# EAGLE design bgm121_breakout_board_v10 (EAGLE 7.7.0)
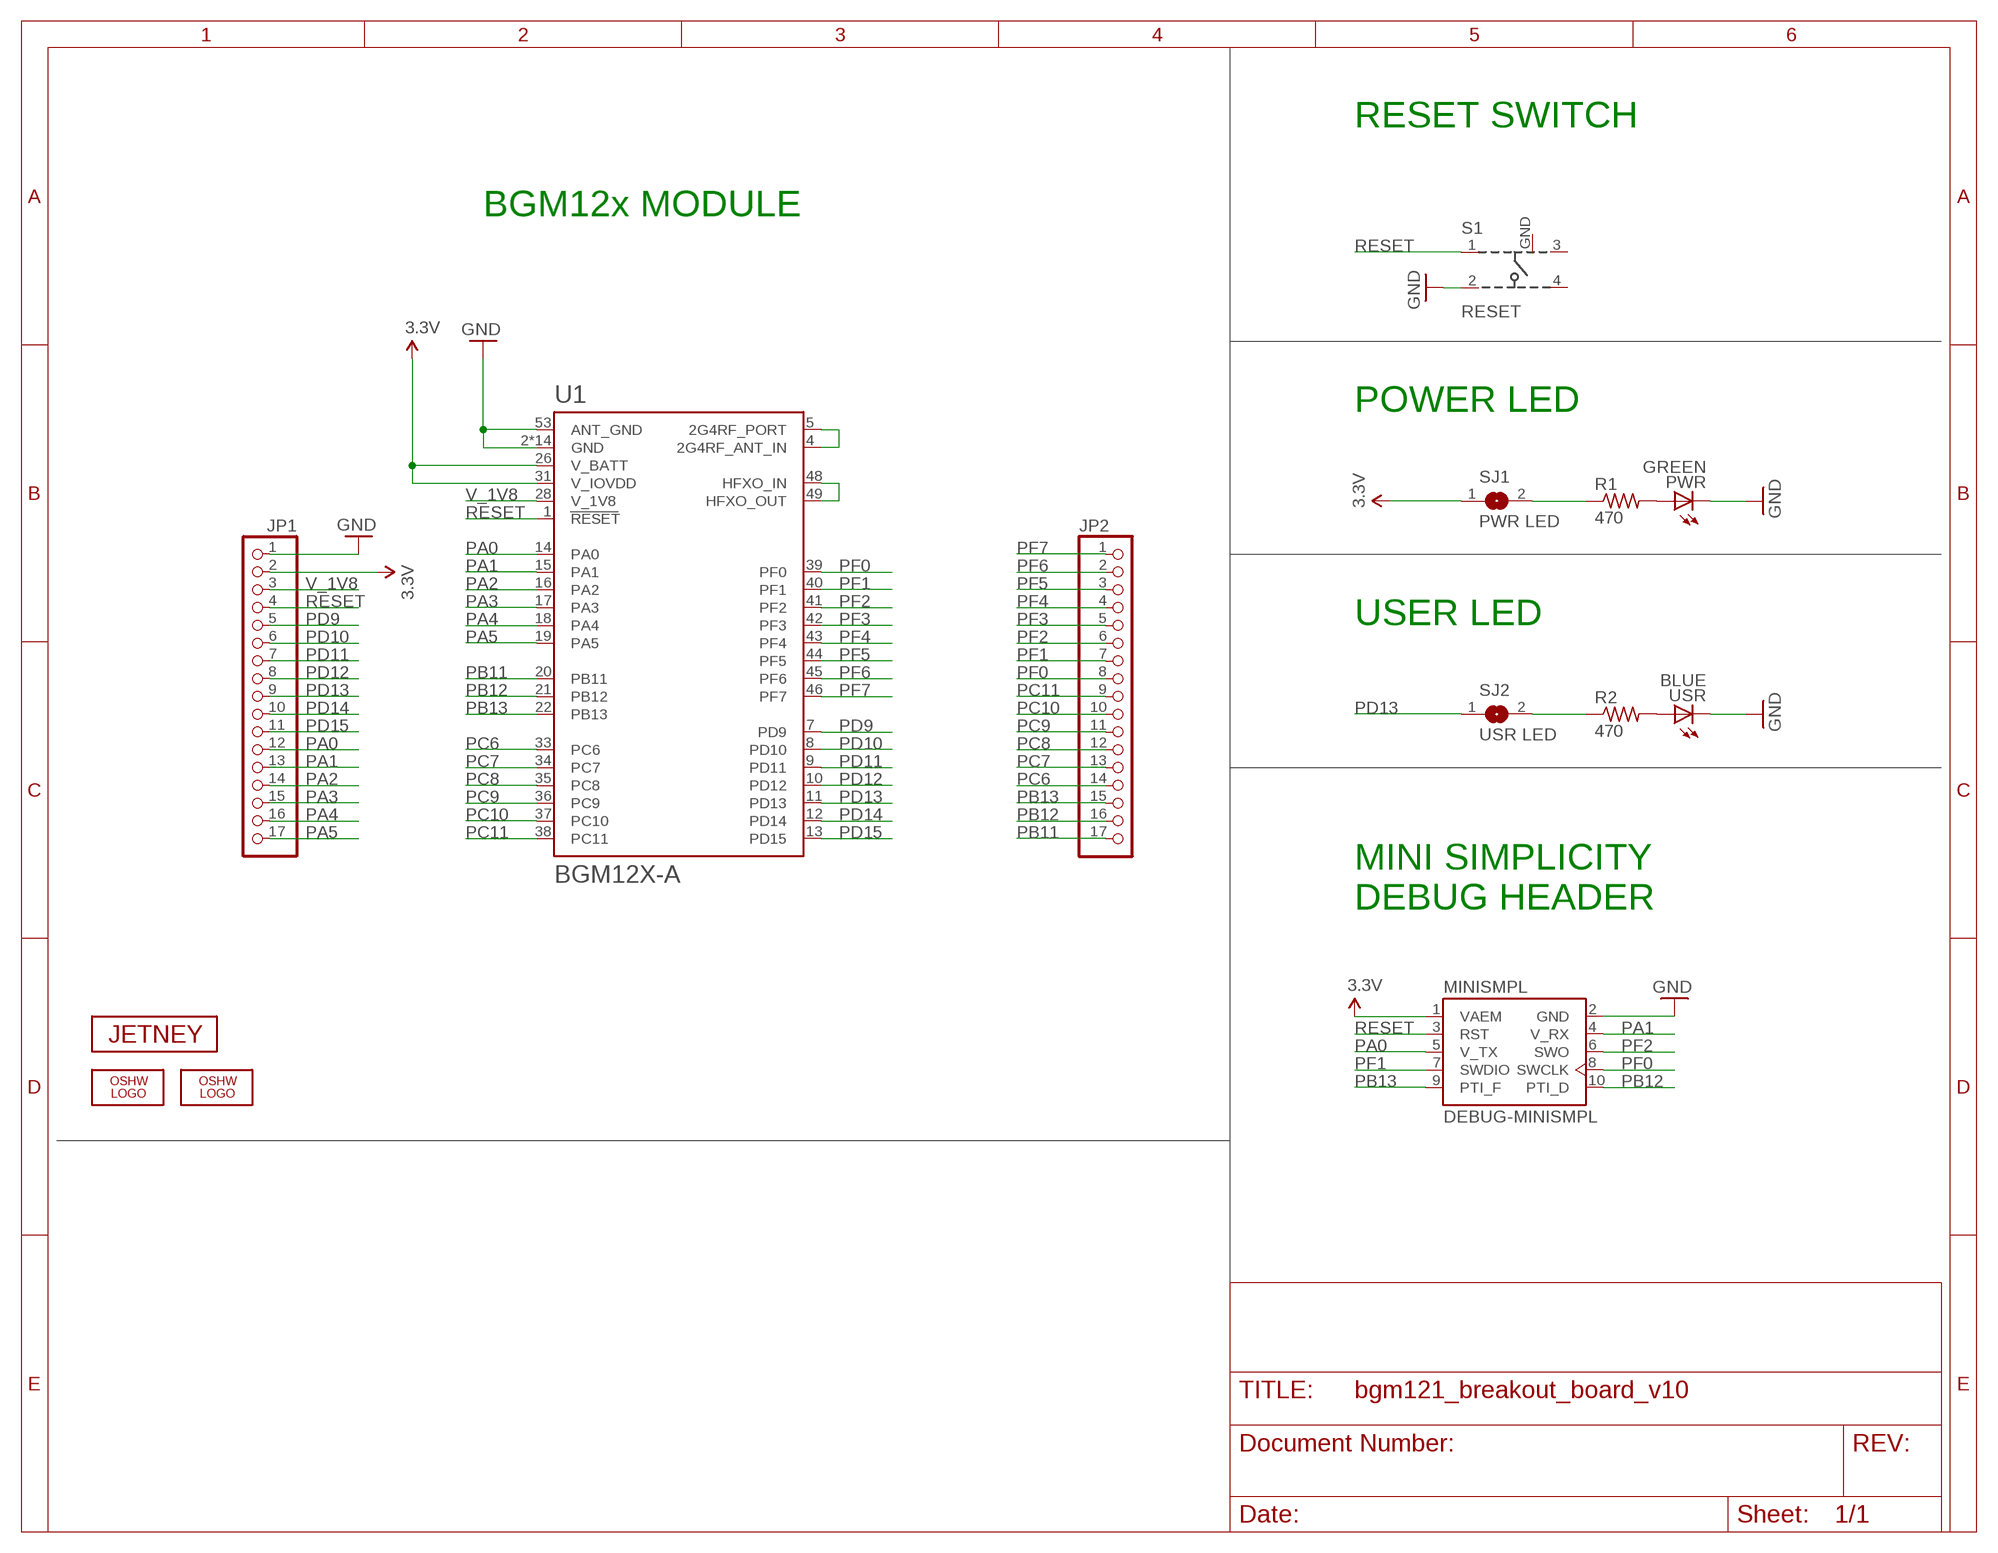
[diagram p0: schematic, sheet 1]

## Parts
JP1  PINHD-1X17  [1X17]
JP2  PINHD-1X17  [1X17]
LOGO1  OSHW_LOGO_FILLX0100-NT  [OSHW_FILLX100_NOTEXT]
LOGO2  OSHW_LOGO_FILLX0070-NT  [OSHW_FILLX70_NOTEXT]
MINISMPL  DEBUG-MINISMPL  [DEBUG-50MIL]
PWR  GREEN  LEDCHIPLED_0805  [CHIPLED_0805]
R1  470  R-US_R0603  [R0603]
R2  470  R-US_R0603  [R0603]
S1  RESET  101-IG  [101-IG]
SJ1  PWR LED  SJ  [SJ]
SJ2  USR LED  SJ  [SJ]
U1  BGM12X-A  [BGM12X-A]
U$2  JETNEY-LOGO-12  [JETNEY-LOGO-12]
USR  BLUE  LEDCHIPLED_0805  [CHIPLED_0805]

## Nets
2G4RF: U1.4(2G4RF_ANT_IN) U1.5(2G4RF_PORT)
3.3V [power]: JP1.2 MINISMPL.1(VAEM) SJ1.1 U1.26(V_BATT) U1.31(V_IOVDD)
GND [power]: JP1.1 MINISMPL.2(GND) PWR.C S1.2 U1.2(GND) U1.3(GND) U1.6(GND) U1.25(GND) U1.27(GND) U1.29(GND) U1.32(GND) U1.47(GND) U1.50(GND) U1.51(GND) U1.52(GND) U1.53(ANT_GND) U1.54(GND) U1.55(GND) U1.56(GND) USR.C
HFXO: U1.48(HFXO_IN) U1.49(HFXO_OUT)
N$1: PWR.A R1.2
N$3 [power]: R1.1 SJ1.2
N$4: R2.2 USR.A
N$5: R2.1 SJ2.2
PA0: JP1.12 MINISMPL.5(V_TX) U1.14(PA0)
PA1: JP1.13 MINISMPL.4(V_RX) U1.15(PA1)
PA2: JP1.14 U1.16(PA2)
PA3: JP1.15 U1.17(PA3)
PA4: JP1.16 U1.18(PA4)
PA5: JP1.17 U1.19(PA5)
PB11: JP2.17 U1.20(PB11)
PB12: JP2.16 MINISMPL.10(PTI_D) U1.21(PB12)
PB13: JP2.15 MINISMPL.9(PTI_F) U1.22(PB13)
PC6: JP2.14 U1.33(PC6)
PC7: JP2.13 U1.34(PC7)
PC8: JP2.12 U1.35(PC8)
PC9: JP2.11 U1.36(PC9)
PC10: JP2.10 U1.37(PC10)
PC11: JP2.9 U1.38(PC11)
PD9: JP1.5 U1.7(PD9)
PD10: JP1.6 U1.8(PD10)
PD11: JP1.7 U1.9(PD11)
PD12: JP1.8 U1.10(PD12)
PD13: JP1.9 SJ2.1 U1.11(PD13)
PD14: JP1.10 U1.12(PD14)
PD15: JP1.11 U1.13(PD15)
PF0: JP2.8 MINISMPL.8(SWCLK) U1.39(PF0)
PF1: JP2.7 MINISMPL.7(SWDIO) U1.40(PF1)
PF2: JP2.6 MINISMPL.6(SWO) U1.41(PF2)
PF3: JP2.5 U1.42(PF3)
PF4: JP2.4 U1.43(PF4)
PF5: JP2.3 U1.44(PF5)
PF6: JP2.2 U1.45(PF6)
PF7: JP2.1 U1.46(PF7)
RESET: JP1.4 MINISMPL.3(RST) S1.1 U1.1(RESET)
V_1V8: JP1.3 U1.28(V_1V8)
Unconnected: S1.3 S1.4

## Notes on the sheet
- RESET SWITCH
- BGM12x MODULE
- POWER LED
- USER LED
- MINI SIMPLICITY
  DEBUG HEADER

## Power pins joined to a net without a drawn wire
GND: S1.GND

## Library data of the parts
JP1 JP2 = sf-pinhead:PINHD-1X17: PIN HEADER
LOGO1 LOGO2 = oshw-logo:OSHW_LOGO_FILL
MINISMPL = jetney-silabs-modules:DEBUG-MINISMPL
PWR USR = led:LED: LED OSRAM: - CHIPLED LG R971, LG N971, LY N971, LG Q971, LY Q971, LO R971, LY R971 LH N974, LH R974 LS Q976, LO Q976, LY Q976 LO Q996 - Hyper CHIPLED LW Q18S LB Q993, LB Q99A, LB R99A - SideLED LS A670, LO A670, LY A670, LG A670, LP A670 LB A673, LV A673, LT A673, LW A673 LH A674 LY A675 LS A676, LA A676, LO A676, LY A676, LW A676 LS A679, LY A679, LG A679 - Hyper Micro SIDELED® LS Y876, LA Y876, LO Y876, LY Y876 LT Y87S - SmartLED LW L88C, LW L88S LB L89C, LB L89S, LG L890 LS L89K, LO L89K, LY L89K LS L896, LA L896, LO L896, LY L896 - TOPLED LS T670, LO T670, LY T670, LG T670, LP T670 LSG T670, LSP T670, LSY T670, LOP T670, LYG T670 LG T671, LOG T671, LSG T671 LB T673, LV T673, LT T673, LW T673 LH T674 LS T676, LA T676, LO T676, LY T676, LB T676, LH T676, LSB T676, LW T676 LB T67C, LV T67C, LT T67C, LS T67K, LO T67K, LY T67K, LW E67C LS E67B, LA E67B, LO E67B, LY E67B, LB E67C, LV E67C, LT E67C LW T67C LS T679, LY T679, LG T679 LS T770, LO T770, LY T770, LG T770, LP T770 LB T773, LV T773, LT T773, LW T773 LH T774 LS E675, LA E675, LY E675, LS T675 LS T776, LA T776, LO T776, LY T776, LB T776 LHGB T686 LT T68C, LB T68C - Hyper Mini TOPLED® LB M676 - Mini TOPLED Santana® LG M470 LS M47K, LO M47K, LY M47K Source: http://www.osram.convergy.de LUXEON: - LUMILED® LXK2-PW12-R00, LXK2-PW12-S00, LXK2-PW14-U00, LXK2-PW14-V00 LXK2-PM12-R00, LXK2-PM12-S00, LXK2-PM14-U00 LXK2-PE12-Q00, LXK2-PE12-R00, LXK2-PE12-S00, LXK2-PE14-T00, LXK2-PE14-U00 LXK2-PB12-K00, LXK2-PB12-L00, LXK2-PB12-M00, LXK2-PB14-N00, LXK2-PB14-P00, LXK2-PB14-Q00 LXK2-PR12-L00, LXK2-PR12-M00, LXK2-PR14-Q00, LXK2-PR14-R00 LXK2-PD12-Q00, LXK2-PD12-R00, LXK2-PD12-S00 LXK2-PH12-R00, LXK2-PH12-S00 LXK2-PL12-P00, LXK2-PL12-Q00, LXK2-PL12-R00 Source: www.luxeon.com KINGBRIGHT: KA-3528ASYC Source: www.kingbright.com
R1 R2 = resistor:R-US_: RESISTOR, American symbol
S1 = sf-keyglove:101-IG
SJ1 SJ2 = jumper:SJ: SMD solder JUMPER
U1 = jetney-silabs-modules:BGM12X-A
U$2 = sf-keyglove:JETNEY-LOGO

## Net classes
0 default: width 0.152 mm, drill 0.33 mm, clearance 0.152 mm
1 power: width 0.254 mm, drill 0.33 mm, clearance 0.152 mm

## Board
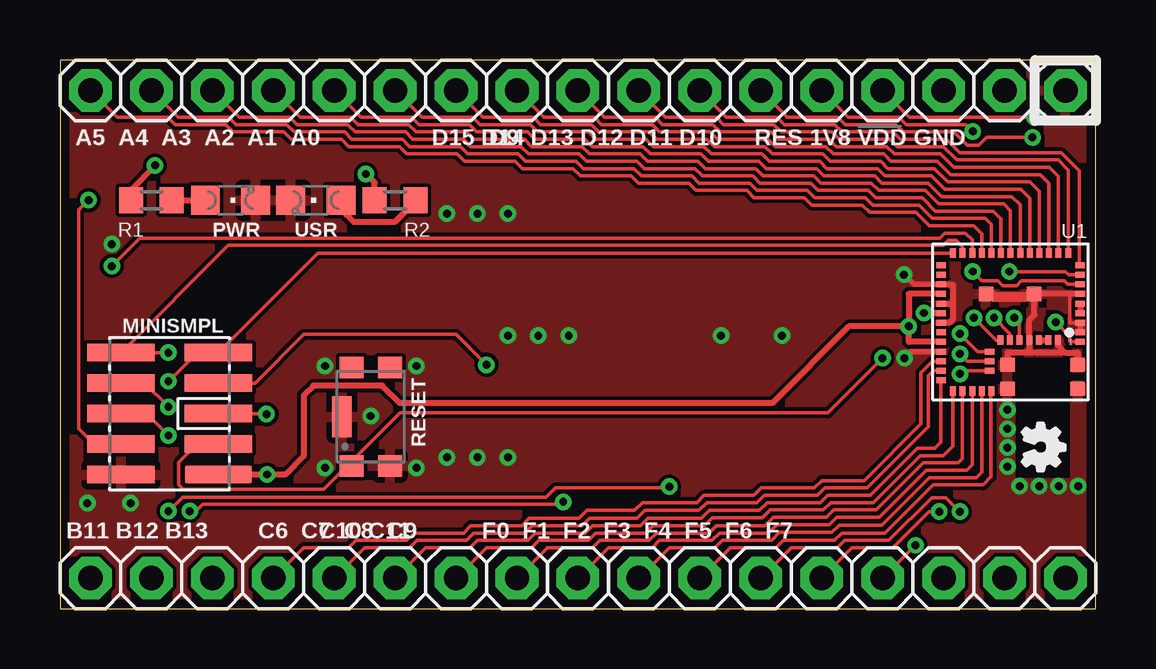
[diagram p1: board, top side]
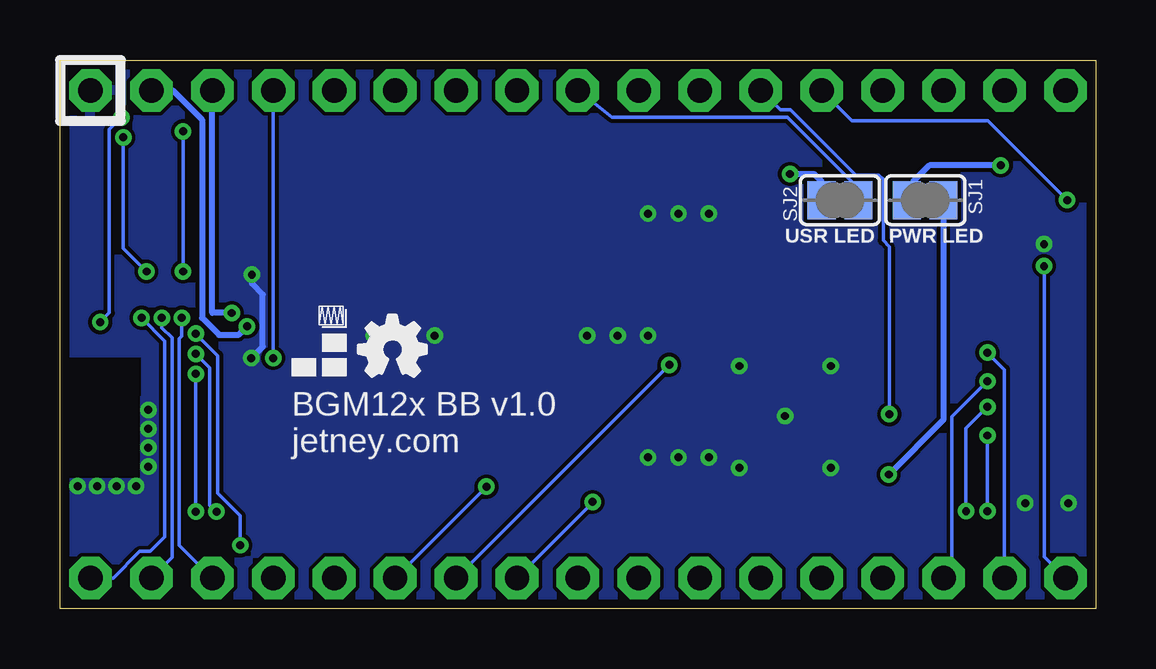
[diagram p2: board, bottom side, seen from below]

Size 43.18 x 22.86 mm. Coordinates in mm from the lower left corner, seen from the top.
Outline: 0,0 43.18,0 43.18,22.86 0,22.86 0,0
Copper layers (1*16): Top 0.0356mm / dielectric 1.5011mm / Bottom 0.0356mm
Design rules "default": minimum track width 6mil, minimum drill 13mil, track to track 6mil, track to pad 6mil, pad to pad 6mil, via to via 6mil, smd to smd 6mil, copper to edge 15mil, drill to drill 6mil, minimum pad ring 7mil, minimum via ring 7mil, stop-mask expansion 4mil, vias tented up to drill 13mil, thermal gap 10mil
tRestrict: area 39.9,5.5 to 42.1,8.9
bRestrict: area 39.9,5.5 to 42.9,8.9

### Footprints (pad centres in the part's own frame; a part is rotated, then mirrored left to right if it is on the bottom)
1X17 = drill 1.016 pad 1.778 octagon: 1 -20.32,0; 2 -17.78,0; 3 -15.24,0; 4 -12.7,0; 5 -10.16,0; 6 -7.62,0; 7 -5.08,0; 8 -2.54,0; 9 0,0; 10 2.54,0; 11 5.08,0; 12 7.62,0; 13 10.16,0; 14 12.7,0; 15 15.24,0; 16 17.78,0; 17 20.32,0
DEBUG-50MIL = smd 0.74 x 2.8: 1 -2.54,-2.03; 2 -2.54,2.03; 3 -1.27,-2.03; 4 -1.27,2.03; 5 0,-2.03; 6 0,2.03; 7 1.27,-2.03; 8 1.27,2.03; 9 2.54,-2.03; 10 2.54,2.03
CHIPLED_0805 = smd 1.2 x 1.2: A 0,-1.05; C 0,1.05
R0603 = smd 1 x 1.1: 1 -0.85,0; 2 0.85,0
101-IG = smd 0.9 x 1: 1 -2.05,0.8; 2 -2.05,-0.8; 3 2.05,0.8; 4 2.05,-0.8 | smd 1.7 x 0.8: GND 0,1.2
SJ = smd 1.168 x 1.6: 1 -0.762,0; 2 0.762,0
BGM12X-A = smd 0.4 x 0.25: 1 -2.9,0.85; 2 -2.9,0.45; 3 -2.9,0.05; 4 -2.9,-0.35; 5 -2.9,-0.75; 6 -2.9,-1.15; 7 -2.9,-1.55; 8 -2.9,-1.95; 9 -2.9,-2.35; 23 2.9,-2.35; 24 2.9,-1.95; 25 2.9,-1.55; 26 2.9,-1.15; 27 2.9,-0.75; 28 2.9,-0.35; 29 2.9,0.05; 30 2.9,0.45; 31 2.9,0.85; 32 2.9,1.25; 33 2.9,1.65; 34 2.9,2.05; 35 2.9,2.45; 41 0.875,2.055; 42 0.875,1.655; 43 0.875,1.255 | smd 0.25 x 0.4: 10 -2.4,-2.85; 11 -2,-2.85; 12 -1.6,-2.85; 13 -1.2,-2.85; 14 -0.8,-2.85; 15 -0.4,-2.85; 16 0,-2.85; 17 0.4,-2.85; 18 0.8,-2.85; 19 1.2,-2.85; 20 1.6,-2.85; 21 2,-2.85; 22 2.4,-2.85; 36 2.4,2.9; 37 2,2.9; 38 1.6,2.9; 39 1.2,2.9; 40 0.8,2.9; 44 0.425,0.775; 45 0.025,0.775; 46 -0.375,0.775; 47 -0.775,0.775; 48 -1.175,0.775; 49 -1.575,0.775; 50 -1.975,0.775 | smd 0.6 x 0.6: 51 -0.975,-1.15; 52 1.025,-1.15; 53 -2.8,2.8; 54 -2.8,1.8; 55 0.125,1.8; 56 0.125,2.8

### Placement (x,y rotation side)
JP1  21.59,21.59 180 top
JP2  21.59,1.27 180 top
LOGO1  30.73,9.68 0 bottom
LOGO2  40.11,7.72 270 top
MINISMPL  4.57,8.13 90 top
PWR  7.11,17.02 270 top
R1  3.81,17.02 0 top
R2  13.97,17.02 0 top
S1  12.95,8 90 top
SJ1  7.11,17.02 180 bottom
SJ2  10.67,17.02 180 bottom
U1  39.62,11.96 180 top
U$2  33.53,9.68 0 bottom
USR  10.67,17.02 90 top

### Tracks (layer width: path | path; a pad name or v marks a point on that pad's centre or on a via)
2G4RF
  Top 0.254: U1.5 U1.4
3.3V  (via drill 0.33)
  Top 0.254: U1.26 35.38,13.11 v35.38,11.76 | v35.38,11.76 32.89,11.76 29.69,8.56 14.17,8.56 13.44,9.3 10.57,9.3 10.16,8.89 10.16,6.35 9.4,5.59 v8.64,5.59 MINISMPL.1 | U1.31 35.4,11.11 v35.38,11.76
  Bottom 0.254: v35.38,11.76 35.74,11.4 36.55,11.4 37.26,12.12 37.26,20.37 38.48,21.59 JP1.2 | SJ1.1 6.35,7.87 v8.64,5.59
GND  (via drill 0.33)
  Top 0.152: 42.09,13.11 42.09,11.91 U1.3
  Top 0.229: U1.25 35.59,13.51 v35.18,13.92 | U1.32 35.48,10.71 v35.2,10.44
  Top 0.254: U1.6 42.09,13.11 U1.51 40.62,13.1 40.62,12.24 40.4,12.03 U1.47 40.4,10.78 40.28,10.67 | U1.50 41.6,10.97 41.91,10.67 | 41.91,10.67 42.42,10.67 | 42.42,10.67 U1.54 42.42,10.67 | U1.29 37.08,11.91 37.21,12.04 37.21,12.62 | U1.25 37.21,13.51 37.21,12.62 | U1.27 37.22,12.71 37.21,12.62 | 40.28,10.67 39.5,10.67 | 39.5,10.67 U1.55 | 41.91,10.67 40.28,10.67 | 39.5,10.67 | U1.3 U1.2
  Top 0.406: U1.52 38.78,13.11 38.89,13.01 40.28,13.01 40.39,13.08 40.57,13.08 U1.51
  Bottom 0.254: v35.2,10.44 34.72,10.92 34.72,13.08 35.18,13.54 v35.18,13.92
  other vias: 12.95,8.03 11.05,10.11 14.86,10.11 14.86,5.87 11.05,5.87 16.13,16.46 17.4,16.46 18.67,16.46 2.16,15.19 41.63,5.11 42.44,5.11 39.5,8.28 39.5,7.49 39.5,6.71 39.5,5.92 18.67,11.38 19.94,11.38 21.21,11.38 18.67,6.3 17.4,6.3 16.13,6.3 30.1,11.38 27.56,11.38 2.95,4.39 1.14,4.39 40.82,5.11 40.01,5.11
  pour Bottom: 0,22.86 43.18,22.86 43.18,0 0,0
  pour Top: 0,22.86 43.18,22.86 43.18,0 0,0
HFXO
  Top 0.254: U1.48 U1.49
N$1
  Top 0.254: R1.2 PWR.A
N$3  (via drill 0.33)
  Top 0.254: R1.1 2.96,17.46 v3.96,18.47
  Bottom 0.254: v3.96,18.47 6.93,18.47 7.62,17.78 7.62,17.27 SJ1.2
N$4
  Top 0.254: R2.2 14.82,16.98 13.95,16.1 12.24,16.1 11.94,16.41 11.94,16.8 USR.A
N$5  (via drill 0.33)
  Top 0.254: R2.1 13.12,17.74 v12.75,18.11
  Bottom 0.254: v12.75,18.11 11.76,18.11 11.43,17.78 SJ2.2
N$6
  Bottom 0.152: 6.6,17.02 7.62,17.02
N$8
  Bottom 0.152: 10.16,17.02 11.18,17.02
PA0  (via drill 0.33)
  Top 0.152: v8.61,8.1 8.59,8.13 MINISMPL.5 | U1.14 40.42,17.11 40.06,17.48 36.88,17.48 36.32,18.03 34.39,18.03 34.09,18.34 31.98,18.34 31.67,18.64 29.57,18.64 29.26,18.95 27.15,18.95 26.85,19.25 24.74,19.25 24.43,19.56 22.33,19.56 22.02,19.86 19.91,19.86 19.61,20.17 17.5,20.17 17.2,20.47 15.09,20.47 JP1.12
  Bottom 0.152: JP1.12 13.16,20.78 12.72,20.78 10.01,18.06 9.04,18.06 8.87,17.88 8.87,15.34 8.61,15.09 v8.61,8.1
PA1  (via drill 0.33)
  Top 0.152: U1.15 40.02,16.82 39.67,17.17 36.75,17.17 36.2,17.73 34.27,17.73 33.96,18.03 31.85,18.03 31.55,18.34 29.44,18.34 29.13,18.64 27.03,18.64 26.72,18.95 24.61,18.95 24.31,19.25 22.2,19.25 21.89,19.56 19.79,19.56 19.48,19.86 17.37,19.86 17.07,20.17 14.96,20.17 14.66,20.47 12.55,20.47 JP1.13 | MINISMPL.4 1.42,6.86 0.79,7.49 0.79,16.61 v1.19,17.02
  Bottom 0.152: v1.19,17.02 4.5,20.32 10.16,20.32 JP1.13
PA2
  Top 0.152: U1.16 39.62,16.59 39.34,16.87 36.63,16.87 36.07,17.42 34.14,17.42 33.83,17.73 31.73,17.73 31.42,18.03 29.31,18.03 29.01,18.34 26.9,18.34 26.59,18.64 24.49,18.64 24.18,18.95 22.07,18.95 21.77,19.25 19.66,19.25 19.36,19.56 17.25,19.56 16.94,19.86 14.83,19.86 14.53,20.17 12.42,20.17 12.12,20.47 10.01,20.47 JP1.14
PA3
  Top 0.152: U1.17 39.22,16.25 38.91,16.56 36.5,16.56 35.94,17.12 34.01,17.12 33.71,17.42 31.6,17.42 31.29,17.73 29.18,17.73 28.88,18.03 26.77,18.03 26.47,18.34 24.36,18.34 24.05,18.64 21.95,18.64 21.64,18.95 19.53,18.95 19.23,19.25 17.12,19.25 16.82,19.56 14.71,19.56 14.4,19.86 12.29,19.86 11.99,20.17 9.88,20.17 9.58,20.47 7.47,20.47 JP1.15
PA4
  Top 0.152: U1.18 38.82,16.02 38.58,16.26 36.37,16.26 35.81,16.82 33.88,16.82 33.58,17.12 31.47,17.12 31.17,17.42 29.06,17.42 28.75,17.73 26.64,17.73 26.34,18.03 24.23,18.03 23.93,18.34 21.82,18.34 21.51,18.64 19.41,18.64 19.1,18.95 16.99,18.95 16.69,19.25 14.58,19.25 14.28,19.56 12.17,19.56 11.86,19.86 9.75,19.86 9.45,20.17 7.34,20.17 7.04,20.47 4.93,20.47 JP1.16
PA5
  Top 0.152: U1.19 38.42,15.63 38.1,15.95 36.25,15.95 35.69,16.51 33.76,16.51 33.45,16.82 31.34,16.82 31.04,17.12 28.93,17.12 28.63,17.42 26.52,17.42 26.21,17.73 24.11,17.73 23.8,18.03 21.69,18.03 21.39,18.34 19.28,18.34 18.97,18.64 16.87,18.64 16.56,18.95 14.45,18.95 14.15,19.25 12.04,19.25 11.73,19.56 9.63,19.56 9.32,19.86 7.21,19.86 6.91,20.17 4.8,20.17 4.5,20.47 2.39,20.47 JP1.17
PB11  (via drill 0.33)
  Top 0.152: U1.20 38.02,15.37 37.74,15.65 36.88,15.65 36.68,15.44 3.33,15.44 v2.16,14.28
  Bottom 0.152: v2.16,14.28 2.16,2.16 JP2.17
PB12  (via drill 0.33)
  Top 0.152: U1.21 37.62,15.08 37.36,15.34 37.03,15.34 36.83,15.14 7.01,15.14 MINISMPL.10 v4.52,10.67
  Bottom 0.152: v4.52,10.67 3.81,9.96 JP2.16
PB13  (via drill 0.33)
  Top 0.152: U1.22 10.75,14.81 MINISMPL.9 5.71,10.67 v4.52,9.47
  Bottom 0.152: v4.52,9.47 5.99,8 5.99,1.63 JP2.15
PC6
  Top 0.152: JP2.14 10.16,2.54 12.04,2.54 12.34,2.85 14.45,2.85 14.76,3.15 16.82,3.15 17.12,3.45 19.25,3.45 19.56,3.76 21.64,3.76 21.97,4.09 23.95,4.09 24.28,4.42 26.54,4.42 26.85,4.72 28.93,4.72 29.23,5.03 31.45,5.03 31.75,5.33 33.53,5.33 35.89,7.7 35.89,9.83 36.37,10.31 U1.33
PC7
  Top 0.152: JP2.13 12.7,2.54 14.58,2.54 14.88,2.85 16.94,2.85 17.25,3.15 19.38,3.15 19.68,3.45 21.77,3.45 22.07,3.76 24.05,3.76 24.38,4.09 26.64,4.09 26.98,4.42 29.06,4.42 29.36,4.72 31.57,4.72 31.88,5.03 33.66,5.03 36.2,7.57 36.2,9.7 36.41,9.91 U1.34
PC8
  Top 0.152: JP2.12 15.24,2.54 17.09,2.54 17.4,2.85 19.51,2.85 19.81,3.15 21.89,3.15 22.2,3.45 24.21,3.45 24.51,3.76 26.75,3.76 27.08,4.09 29.16,4.09 29.49,4.42 31.7,4.42 32,4.72 33.78,4.72 35.74,6.68 36.47,6.68 36.72,6.93 U1.35
PC9
  Top 0.152: JP2.11 17.78,2.54 19.66,2.54 19.96,2.85 22.02,2.85 22.33,3.15 24.41,3.15 24.71,3.45 26.87,3.45 27.2,3.79 29.29,3.79 29.62,4.12 31.83,4.12 32.13,4.42 33.91,4.42 35.87,6.38 36.83,6.38 37.22,6.77 U1.36
PC10
  Top 0.152: U1.37 37.62,6.25 37.44,6.07 35.99,6.07 34.04,4.12 32.26,4.12 31.95,3.81 29.74,3.81 29.39,3.45 27.36,3.45 27.05,3.15 24.87,3.15 24.56,2.85 22.5,2.85 22.2,2.54 20.32,2.54 JP2.10
PC11
  Top 0.152: U1.38 38.02,6 37.8,5.77 36.12,5.77 34.16,3.81 32.38,3.81 32.08,3.5 29.9,3.5 29.54,3.15 27.48,3.15 27.18,2.85 24.99,2.85 24.69,2.54 22.86,2.54 JP2.9
PD9  (via drill 0.33)
  Top 0.152: U1.7 42.01,13.51 41.86,13.66 40.08,13.66 39.88,13.46 39.29,13.46 39.09,13.66 38.43,13.66 v38.05,14.05 | v38.05,19.89 37.77,20.17 35.28,20.17 34.98,20.47 32.87,20.47 JP1.5
  Bottom 0.152: v38.05,14.05 v38.05,19.89
PD10  (via drill 0.33)
  Top 0.152: v39.57,14.05 41.91,14.05 42.04,13.91 U1.8 | JP1.6 30.33,20.47 32.44,20.47 32.74,20.17 34.85,20.17 35.15,19.86 37.26,19.86 37.82,19.3 38.3,19.3 38.63,19.63 v40.54,19.63
  Bottom 0.152: v39.57,14.05 40.54,15.01 v40.54,19.63
PD11
  Top 0.152: JP1.7 27.79,20.47 29.9,20.47 30.2,20.17 32.31,20.17 32.61,19.86 34.72,19.86 35.03,19.56 36.96,19.56 37.52,19 41.73,19 42.49,18.24 42.49,14.34 U1.9
PD12
  Top 0.152: U1.10 42.02,18.28 41.6,18.69 37.39,18.69 36.83,19.25 34.9,19.25 34.59,19.56 32.49,19.56 32.18,19.86 30.07,19.86 29.77,20.17 27.66,20.17 27.36,20.47 25.25,20.47 JP1.8
PD13
  Top 0.152: U1.11 41.62,18.02 41.25,18.39 37.26,18.39 36.7,18.95 34.77,18.95 34.47,19.25 32.36,19.25 32.05,19.56 29.95,19.56 29.64,19.86 27.53,19.86 27.23,20.17 25.12,20.17 24.82,20.47 22.71,20.47 JP1.9
  Bottom 0.152: JP1.9 20.17,20.47 12.85,20.47 9.91,17.53 SJ2.1
PD14
  Top 0.152: U1.12 41.22,17.73 40.87,18.09 37.13,18.09 36.58,18.64 34.65,18.64 34.34,18.95 32.23,18.95 31.93,19.25 29.82,19.25 29.52,19.56 27.41,19.56 27.1,19.86 24.99,19.86 24.69,20.17 22.58,20.17 22.28,20.47 20.17,20.47 JP1.10
PD15
  Top 0.152: U1.13 40.82,17.39 40.44,17.78 37.01,17.78 36.45,18.34 34.52,18.34 34.21,18.64 32.11,18.64 31.8,18.95 29.69,18.95 29.39,19.25 27.28,19.25 26.98,19.56 24.87,19.56 24.56,19.86 22.45,19.86 22.15,20.17 20.04,20.17 19.74,20.47 17.63,20.47 JP1.11
PF0  (via drill 0.33)
  Top 0.152: U1.39 38.42,5.68 38.2,5.46 36.25,5.46 34.27,3.48 32.49,3.48 32.18,3.17 30,3.17 29.67,2.85 27.61,2.85 27.3,2.54 25.4,2.54 JP2.8 | MINISMPL.8 3.53,9.4 v4.52,8.41 | v5.41,4.06 5.66,4.06 5.94,4.34 20.88,4.34 v20.98,4.45
  Bottom 0.152: v4.52,8.41 5.41,7.52 v5.41,4.06 | v20.98,4.45 20.98,4.42 JP2.8
PF1  (via drill 0.33)
  Top 0.152: U1.40 38.81,5.49 38.48,5.16 36.4,5.16 34.39,3.15 32.59,3.15 32.28,2.85 30.15,2.85 29.84,2.54 27.94,2.54 JP2.7 | MINISMPL.7 8.13,9.4 10.16,11.43 16.51,11.43 v17.78,10.16
  Bottom 0.152: v17.78,10.16 JP2.7
PF2  (via drill 0.33)
  Top 0.152: U1.41 37.65,9.91 v37.52,9.78 | v37.52,4.04 36.93,4.62 36.35,4.62 34.54,2.85 32.72,2.85 32.41,2.54 30.48,2.54 JP2.6 | MINISMPL.6 3.61,8.13 v4.52,7.21 | v4.52,4.06 5.11,4.65 20.27,4.65 20.65,5.03 25.35,5.03 v25.4,5.08
  Bottom 0.152: v37.52,9.78 v37.52,4.04 | v4.52,7.21 v4.52,4.06 | v25.4,5.08 JP2.6
PF3  (via drill 0.33)
  Top 0.152: U1.42 37.83,10.31 v37.52,10.62 | JP2.5 33.02,2.54 34.72,2.54 36.22,4.04 v36.65,4.04
  Bottom 0.152: v37.52,10.62 36.93,10.03 36.93,4.32 v36.65,4.04
PF4  (via drill 0.33)
  Top 0.152: U1.43 38.26,10.71 v37.52,11.46 | v35.66,2.64 JP2.4
  Bottom 0.152: v37.52,11.46 36.6,10.54 36.6,4.8 35.66,3.86 v35.66,2.64
PF5  (via drill 0.33)
  Top 0.152: U1.44 39.03,11.19 v38.1,12.12
  Bottom 0.152: v38.1,12.12 38.1,11.35 38.2,11.25 38.2,2.64 JP2.3
PF6  (via drill 0.33)
  Top 0.152: U1.45 39.6,11.46 v38.94,12.12
  Bottom 0.152: v38.94,12.12 38.94,11.71 38.51,11.28 38.51,2.13 JP2.2
PF7  (via drill 0.33)
  Top 0.152: U1.46 40,11.89 v39.78,12.12
  Bottom 0.152: JP2.1 40.97,1.27 39.85,2.39 39.42,2.39 38.81,3 38.81,11.15 v39.78,12.12
RESET  (via drill 0.33)
  Top 0.152: U1.1 42.1,11.11 42.1,11.34 v41.5,11.94 | v40.62,20.47 35.41,20.47 JP1.4 | v34.29,10.44 32,8.15 14.17,8.15 12.15,6.13 | 12.15,6.13 S1.1 | 12.15,6.13 11,4.98 5.13,4.98 4.95,5.16 4.95,6.1 5.71,6.86 MINISMPL.3
  Bottom 0.152: v41.5,11.94 41.12,12.32 41.12,19.96 v40.62,20.47 | JP1.4 v34.29,10.44
V_1V8  (via drill 0.33)
  Top 0.254: U1.28 36.17,12.31 v36.02,12.32
  Bottom 0.254: v36.02,12.32 36.83,12.32 JP1.3

### Text on the board
tPlace: A5 A4 A3 A2 A1 A0 D9 | D15 D14 D13 D12 D11 D10 RES 1V8 VDD GND | RESET | B11 B12 B13 C10 C11 | C6 C7 C8 C9 F0 F1 F2 F3 F4 F5 F6 F7
bPlace: PWR LED | USR LED | BGM12x BB v1.0 | jetney.com